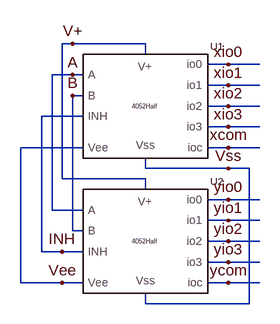
[diagram p0: schematic 4052_2.asc]
4052_2.asc, the LTspice schematic file:
Version 4
SHEET 1 880 680
WIRE -144 448 -144 240
WIRE -112 400 -112 192
WIRE -96 336 -96 128
WIRE -80 288 -80 80
WIRE -80 400 -112 400
WIRE -80 448 -144 448
WIRE -64 80 -80 80
WIRE -64 128 -96 128
WIRE -64 368 -64 160
WIRE -48 128 -64 128
WIRE -48 160 -64 160
WIRE -48 192 -112 192
WIRE -48 240 -144 240
WIRE -48 336 -96 336
WIRE -48 368 -64 368
WIRE -48 400 -80 400
WIRE -48 448 -80 448
WIRE 48 80 -64 80
WIRE 48 96 48 80
WIRE 48 272 48 256
WIRE 48 288 -80 288
WIRE 48 304 48 288
WIRE 48 480 48 464
WIRE 176 112 144 112
WIRE 176 144 144 144
WIRE 176 176 144 176
WIRE 176 208 144 208
WIRE 176 240 144 240
WIRE 176 272 48 272
WIRE 176 320 144 320
WIRE 176 352 144 352
WIRE 176 384 144 384
WIRE 176 416 144 416
WIRE 176 448 144 448
WIRE 208 272 176 272
WIRE 208 480 48 480
WIRE 208 480 208 272
WIRE 224 112 176 112
WIRE 224 144 176 144
WIRE 224 176 176 176
WIRE 224 208 176 208
WIRE 224 240 176 240
WIRE 224 320 176 320
WIRE 224 352 176 352
WIRE 224 384 176 384
WIRE 224 416 176 416
WIRE 224 448 176 448
FLAG -64 128 A
FLAG -64 160 B
FLAG -80 400 INH
FLAG -80 448 Vee
FLAG 176 112 xio0
FLAG 176 144 xio1
FLAG 176 176 xio2
FLAG 176 208 xio3
FLAG 176 240 xcom
FLAG 176 320 yio0
FLAG 176 352 yio1
FLAG 176 384 yio2
FLAG 176 416 yio3
FLAG 176 448 ycom
FLAG 176 272 Vss
FLAG -64 80 V+
SYMBOL 4052bHalf 48 176 R0
SYMATTR InstName U1
SYMBOL 4052bHalf 48 384 R0
SYMATTR InstName U2

The netlist it stands for:
* 4052_2.asc
XU1 A B INH xio0 xio1 xio2 xio3 xcom V+ Vss Vee 4052Half  ; pins A B INH io0 io1 io2 io3 ioc V+ Vss Vee
XU2 A B INH yio0 yio1 yio2 yio3 ycom V+ Vss Vee 4052Half  ; pins A B INH io0 io1 io2 io3 ioc V+ Vss Vee
.lib SwitchAna.Lib
.backanno
.end